# EAGLE design driver (EAGLE 9.5.1)

## Sheet 1 of 3
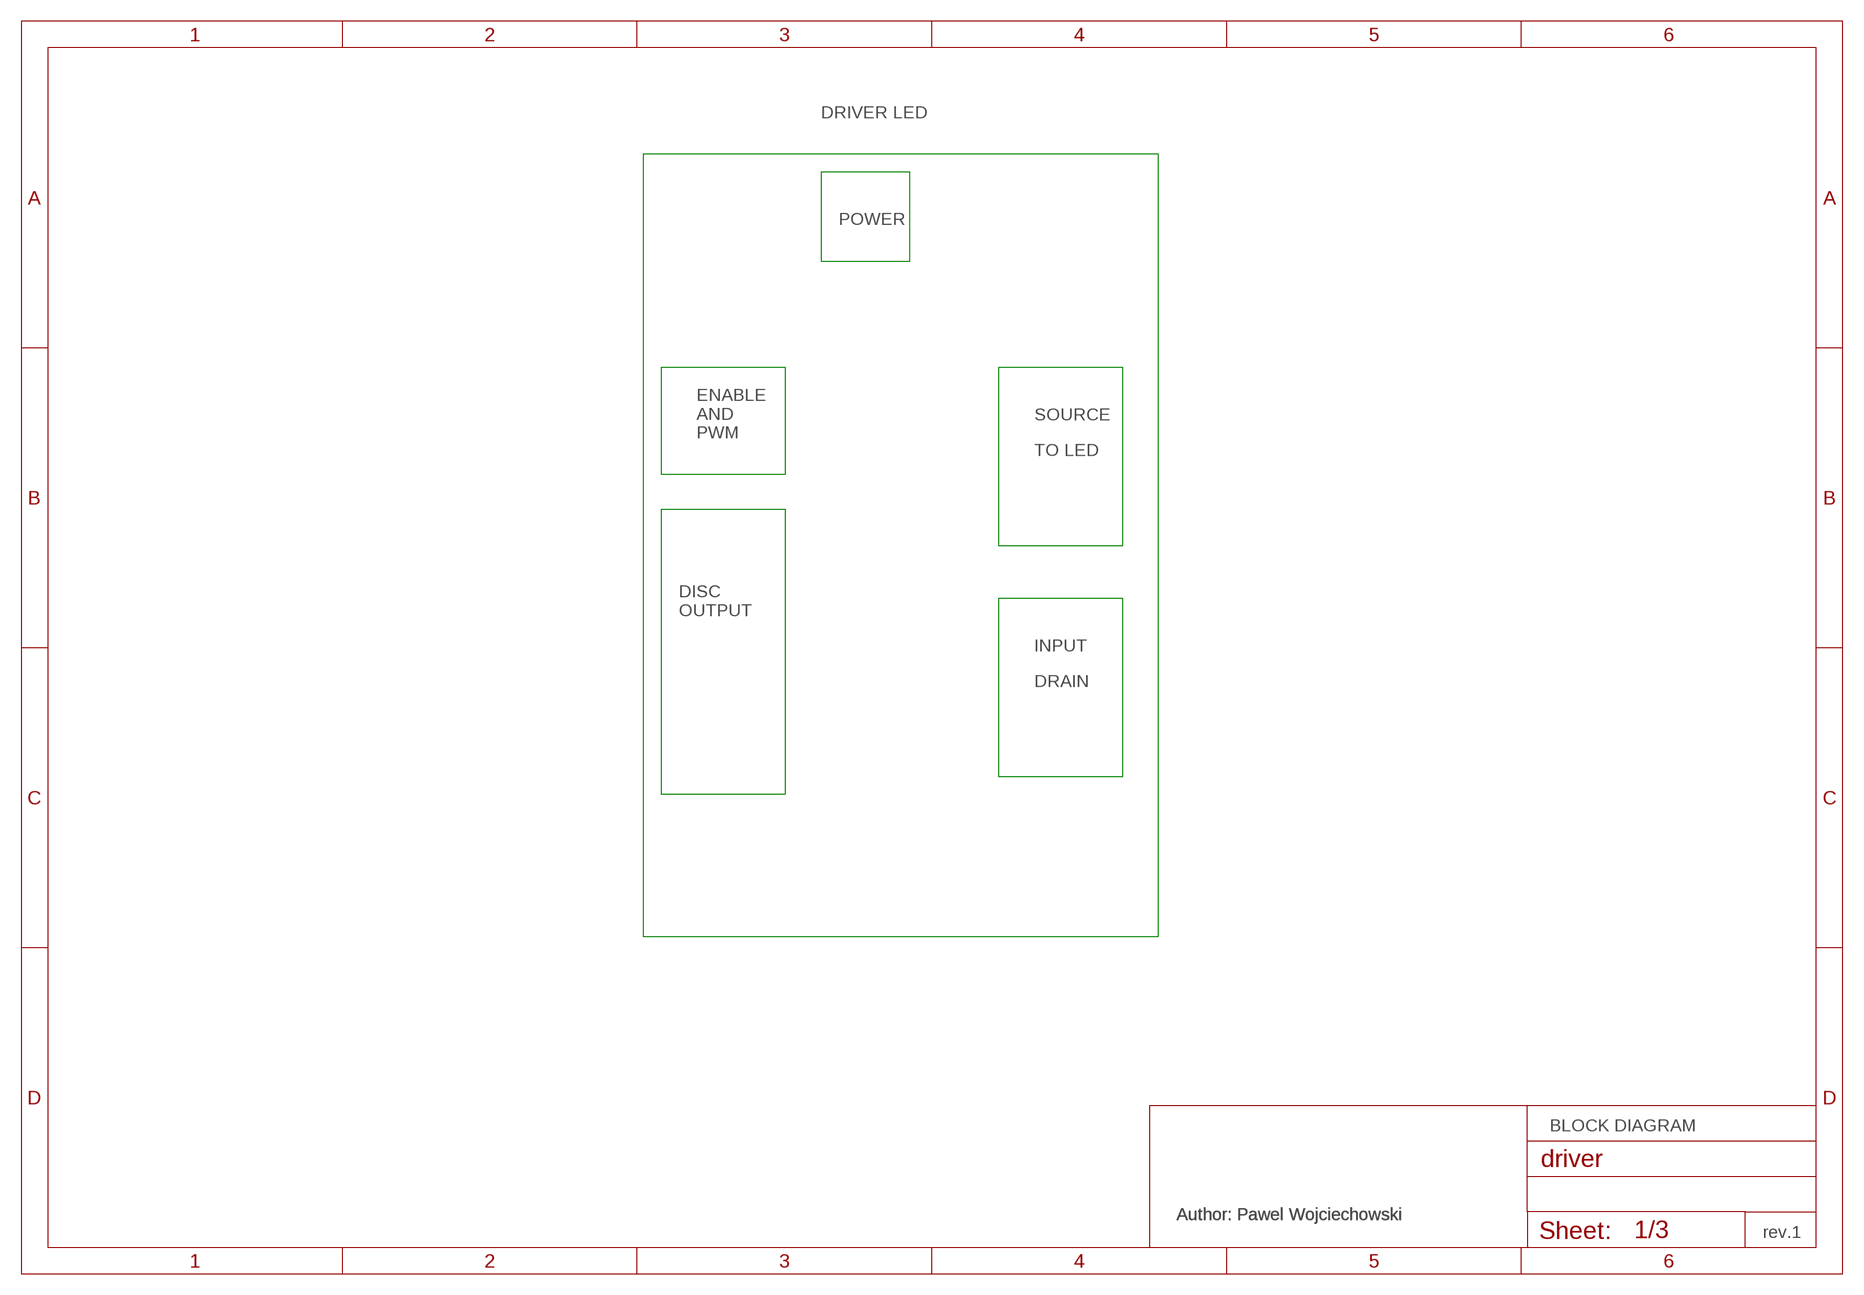
[diagram p0: schematic, sheet 1]

### Notes on the sheet
- DRIVER LED
- POWER
- SOURCE
- ENABLE
  AND
  PWM
- TO LED
- DISC
  OUTPUT
- INPUT
- DRAIN
- BLOCK DIAGRAM
- Author: Pawel Wojciechowski | Author: Pawel Wojciechowski
- rev.1

## Sheet 2 of 3
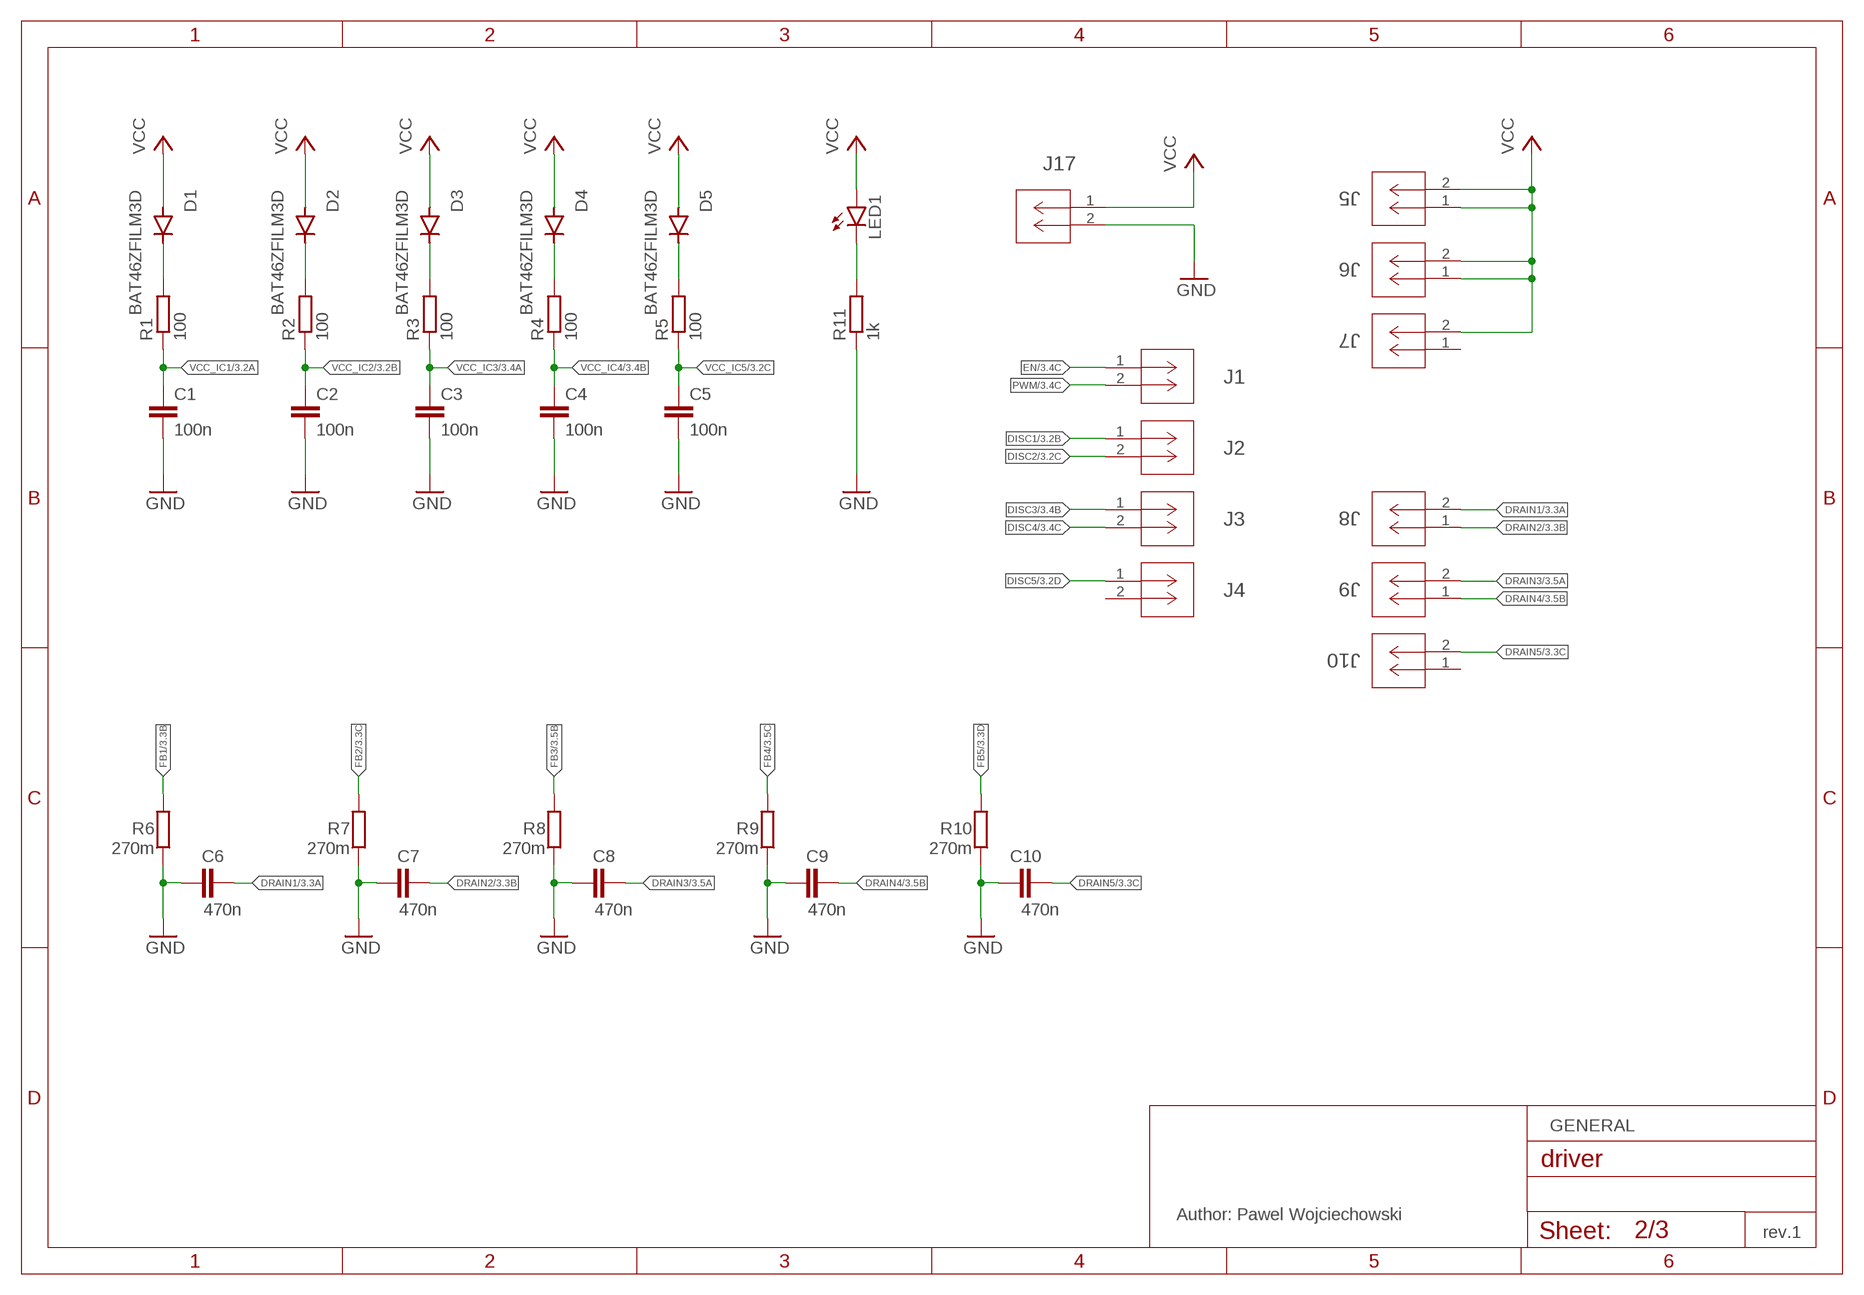
[diagram p1: schematic, sheet 2]

### Parts
C1  100n  C-EUC0603  [C0603]
C2  100n  C-EUC0603  [C0603]
C3  100n  C-EUC0603  [C0603]
C4  100n  C-EUC0603  [C0603]
C5  100n  C-EUC0603  [C0603]
C6  470n  C-EUC0805  [C0805]
C7  470n  C-EUC0805  [C0805]
C8  470n  C-EUC0805  [C0805]
C9  470n  C-EUC0805  [C0805]
C10  470n  C-EUC0805  [C0805]
D1  BAT46ZFILM3D  [SOD-123]
D2  BAT46ZFILM3D  [SOD-123]
D3  BAT46ZFILM3D  [SOD-123]
D4  BAT46ZFILM3D  [SOD-123]
D5  BAT46ZFILM3D  [SOD-123]
J1  1776275-2  [CONN2_1776275-2]
J2  1776275-2  [CONN2_1776275-2]
J3  1776275-2  [CONN2_1776275-2]
J4  1776275-2  [CONN2_1776275-2]
J5  1776275-2  [CONN2_1776275-2]
J6  1776275-2  [CONN2_1776275-2]
J7  1776275-2  [CONN2_1776275-2]
J8  1776275-2  [CONN2_1776275-2]
J9  1776275-2  [CONN2_1776275-2]
J10  1776275-2  [CONN2_1776275-2]
J17  1776275-2  [CONN2_1776275-2]
LED1  LEDSMT1206  [1206]
R1  100  R-EU_R0603  [R0603]
R2  100  R-EU_R0603  [R0603]
R3  100  R-EU_R0603  [R0603]
R4  100  R-EU_R0603  [R0603]
R5  100  R-EU_R0603  [R0603]
R6  270m  R-EU_R0603  [R0603]
R7  270m  R-EU_R0603  [R0603]
R8  270m  R-EU_R0603  [R0603]
R9  270m  R-EU_R0603  [R0603]
R10  270m  R-EU_R0603  [R0603]
R11  1k  R-EU_R0603  [R0603]

### Nets
DISC1: J2.1 ; also sheet 3
DISC2: J2.2 ; also sheet 3
DISC3: J3.1 ; also sheet 3
DISC4: J3.2 ; also sheet 3
DISC5: J4.1 ; also sheet 3
DRAIN1: C6.2 J8.2 ; also sheet 3
DRAIN2: C7.2 J8.1 ; also sheet 3
DRAIN3: C8.2 J9.2 ; also sheet 3
DRAIN4: C9.2 J9.1 ; also sheet 3
DRAIN5: C10.2 J10.2 ; also sheet 3
EN: J1.1 ; also sheet 3
FB1: R6.2 ; also sheet 3
FB2: R7.2 ; also sheet 3
FB3: R8.2 ; also sheet 3
FB4: R9.2 ; also sheet 3
FB5: R10.2 ; also sheet 3
GND: C1.2 C2.2 C3.2 C4.2 C5.2 C6.1 C7.1 C8.1 C9.1 C10.1 J17.2 R6.1 R7.1 R8.1 R9.1 R10.1 R11.1 ; also sheet 3
N$5: D1.C R1.2
N$6: D2.C R2.2
N$7: D3.C R3.2
N$8: D4.C R4.2
N$9: D5.C R5.2
N$10: LED1.C R11.2
PWM: J1.2 ; also sheet 3
VCC: D1.A D2.A D3.A D4.A D5.A J5.1 J5.2 J6.1 J6.2 J7.2 J17.1 LED1.A
VCC_IC1: C1.1 R1.1 ; also sheet 3
VCC_IC2: C2.1 R2.1 ; also sheet 3
VCC_IC3: C3.1 R3.1 ; also sheet 3
VCC_IC4: C4.1 R4.1 ; also sheet 3
VCC_IC5: C5.1 R5.1 ; also sheet 3
Unconnected: J4.2 J7.1 J10.1

### Notes on the sheet
- GENERAL
- Author: Pawel Wojciechowski
- rev.1

## Sheet 3 of 3
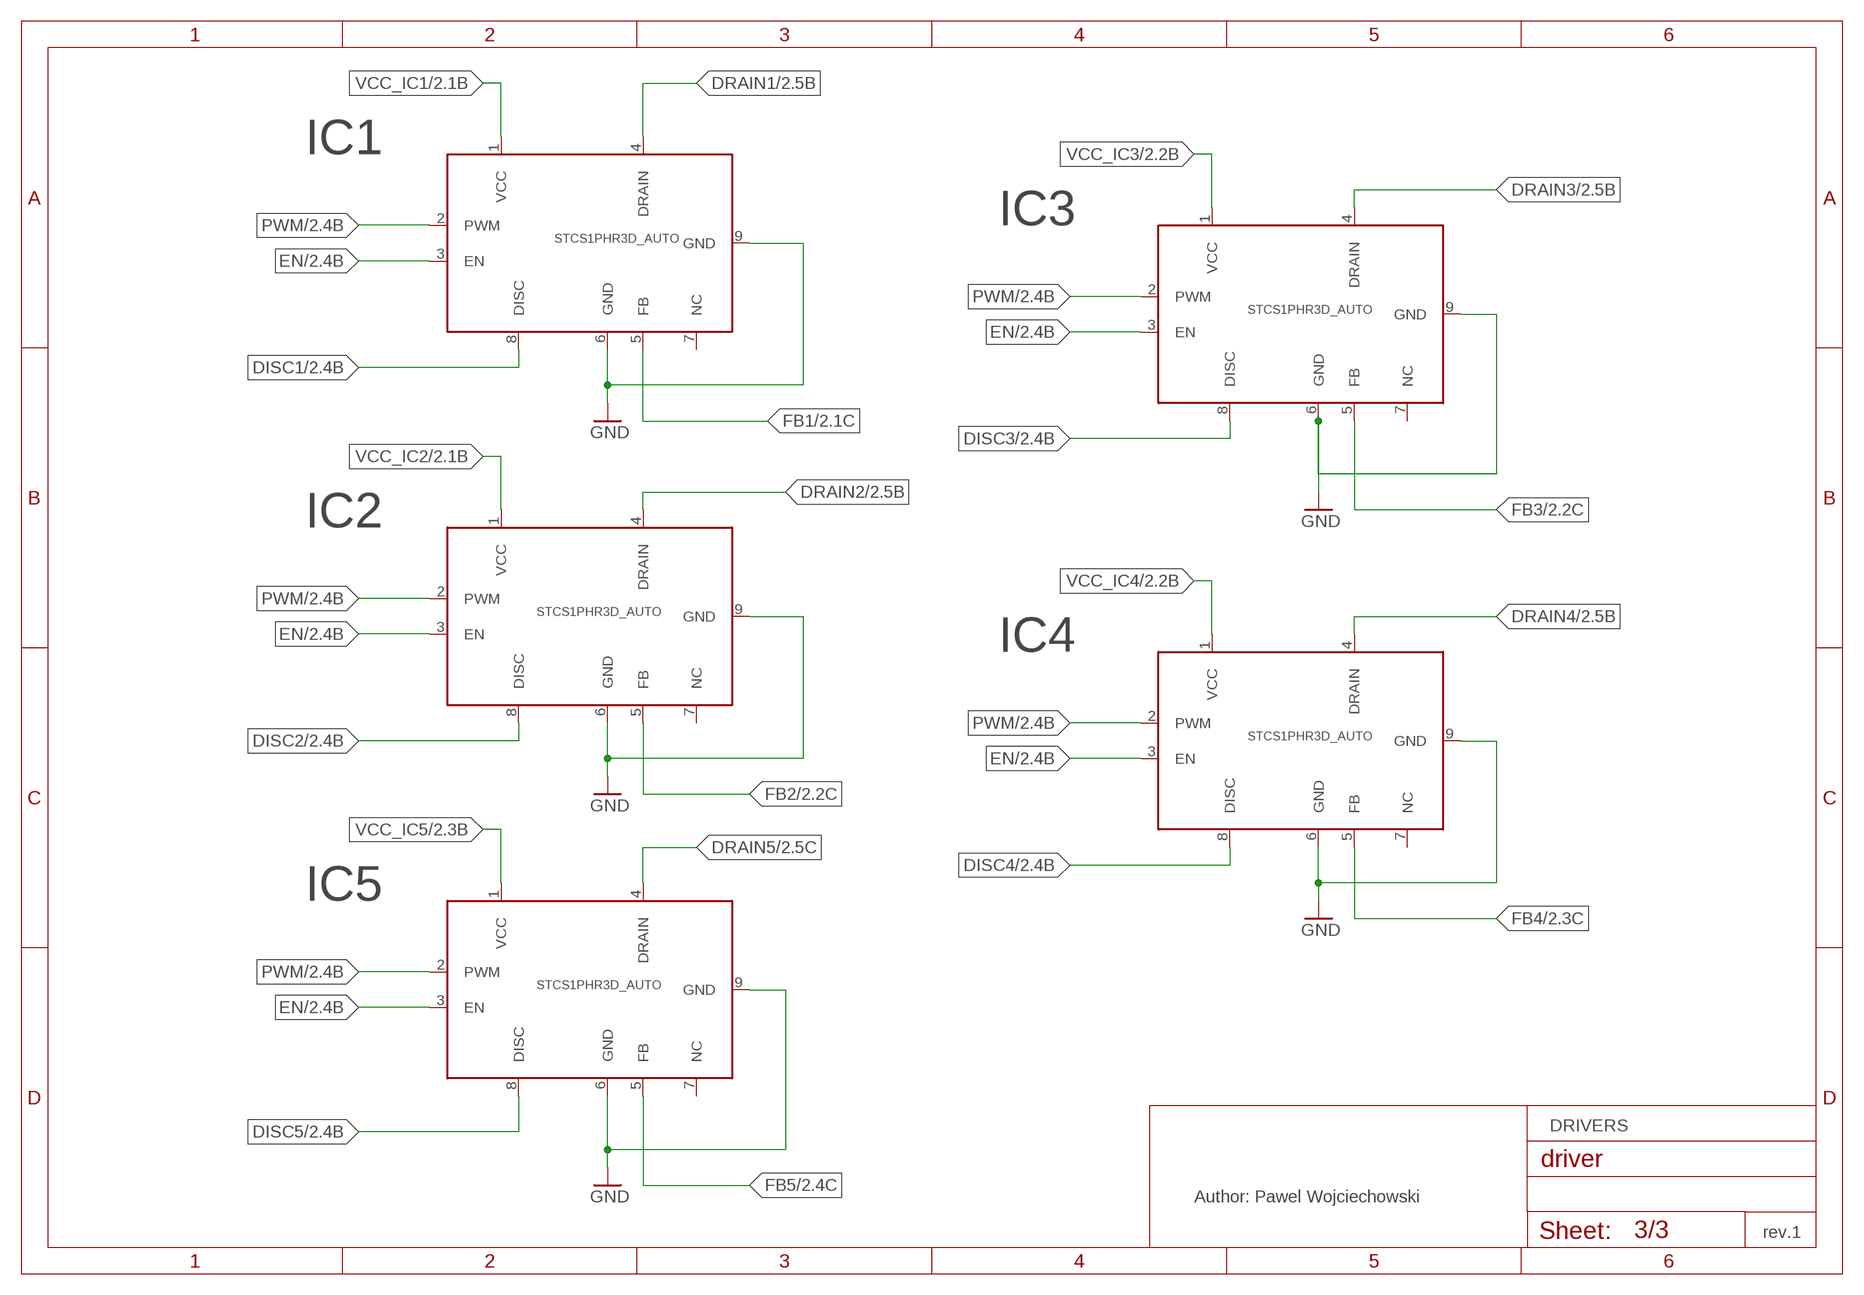
[diagram p2: schematic, sheet 3]

### Parts
IC1  STCS1PHR3D_AUTO  [SOIC127P600X170-9T251X320N]
IC2  STCS1PHR3D_AUTO  [SOIC127P600X170-9T251X320N]
IC3  STCS1PHR3D_AUTO  [SOIC127P600X170-9T251X320N]
IC4  STCS1PHR3D_AUTO  [SOIC127P600X170-9T251X320N]
IC5  STCS1PHR3D_AUTO  [SOIC127P600X170-9T251X320N]

### Nets
DISC1: IC1.8(DISC) ; also sheet 2
DISC2: IC2.8(DISC) ; also sheet 2
DISC3: IC3.8(DISC) ; also sheet 2
DISC4: IC4.8(DISC) ; also sheet 2
DISC5: IC5.8(DISC) ; also sheet 2
DRAIN1: IC1.4(DRAIN) ; also sheet 2
DRAIN2: IC2.4(DRAIN) ; also sheet 2
DRAIN3: IC3.4(DRAIN) ; also sheet 2
DRAIN4: IC4.4(DRAIN) ; also sheet 2
DRAIN5: IC5.4(DRAIN) ; also sheet 2
EN: IC1.3(EN) IC2.3(EN) IC3.3(EN) IC4.3(EN) IC5.3(EN) ; also sheet 2
FB1: IC1.5(FB) ; also sheet 2
FB2: IC2.5(FB) ; also sheet 2
FB3: IC3.5(FB) ; also sheet 2
FB4: IC4.5(FB) ; also sheet 2
FB5: IC5.5(FB) ; also sheet 2
GND: IC1.6(GND) IC1.9(GND) IC2.6(GND) IC2.9(GND) IC3.6(GND) IC3.9(GND) IC4.6(GND) IC4.9(GND) IC5.6(GND) IC5.9(GND) ; also sheet 2
PWM: IC1.2(PWM) IC2.2(PWM) IC3.2(PWM) IC4.2(PWM) IC5.2(PWM) ; also sheet 2
VCC_IC1: IC1.1(VCC) ; also sheet 2
VCC_IC2: IC2.1(VCC) ; also sheet 2
VCC_IC3: IC3.1(VCC) ; also sheet 2
VCC_IC4: IC4.1(VCC) ; also sheet 2
VCC_IC5: IC5.1(VCC) ; also sheet 2
Unconnected: IC1.7(NC) IC2.7(NC) IC3.7(NC) IC4.7(NC) IC5.7(NC)

### Notes on the sheet
- DRIVERS
- Author: Pawel Wojciechowski
- rev.1

## Library data of the parts
C1-C10 = rcl:C-EU: CAPACITOR, European symbol; SPICEPREFIX: C
D1-D5 = LED_LoRa:BAT46ZFILM
IC1-IC5 = LED_LoRa:STCS1PHR
J1-J10 J17 = TE_1776275-2:1776275-2; BUILT_BY: EMA_UL_Team; COPYRIGHT: Copyright (C) 2016 Accelerated Designs. All rights reserved; DATASHEET: https://www.te.com/commerce/DocumentDelivery/DDEController?Action=srchrtrv&DocNm=1776275&DocType=Customer+Drawing&DocLang=English&DocFormat=pdf&PartCntxt=1776275-2; DESCRIPTION: Vertical Term Blk Side Wire En; MANUFACTURER_PART_NUMBER: 1776275-2; PITCH_MM_: 3.5; POSITIONS: 2; PRODUCT: Terminal Block Headers & Receptacles; ROWS-CONFIG: -; SOURCELIBRARY: TE_Connectivity_250_Part_Delivery_6_2018-09-18; TE_PART_NUMBER: 1776275-2; TYPE: Receptacle; VENDOR: TE Connectivity
LED1 = led:LED: LED OSRAM: - CHIPLED LG R971, LG N971, LY N971, LG Q971, LY Q971, LO R971, LY R971 LH N974, LH R974 LS Q976, LO Q976, LY Q976 LO Q996 - Hyper CHIPLED LW Q18S LB Q993, LB Q99A, LB R99A - SideLED LS A670, LO A670, LY A670, LG A670, LP A670 LB A673, LV A673, LT A673, LW A673 LH A674 LY A675 LS A676, LA A676, LO A676, LY A676, LW A676 LS A679, LY A679, LG A679 - Hyper Micro SIDELED® LS Y876, LA Y876, LO Y876, LY Y876 LT Y87S - SmartLED LW L88C, LW L88S LB L89C, LB L89S, LG L890 LS L89K, LO L89K, LY L89K LS L896, LA L896, LO L896, LY L896 - TOPLED LS T670, LO T670, LY T670, LG T670, LP T670 LSG T670, LSP T670, LSY T670, LOP T670, LYG T670 LG T671, LOG T671, LSG T671 LB T673, LV T673, LT T673, LW T673 LH T674 LS T676, LA T676, LO T676, LY T676, LB T676, LH T676, LSB T676, LW T676 LB T67C, LV T67C, LT T67C, LS T67K, LO T67K, LY T67K, LW E67C LS E67B, LA E67B, LO E67B, LY E67B, LB E67C, LV E67C, LT E67C LW T67C LS T679, LY T679, LG T679 LS T770, LO T770, LY T770, LG T770, LP T770 LB T773, LV T773, LT T773, LW T773 LH T774 LS E675, LA E675, LY E675, LS T675 LS T776, LA T776, LO T776, LY T776, LB T776 LHGB T686 LT T68C, LB T68C - Hyper Mini TOPLED® LB M676 - Mini TOPLED Santana® LG M470 LS M47K, LO M47K, LY M47K Source: http://www.osram.convergy.de LUXEON: - LUMILED® LXK2-PW12-R00, LXK2-PW12-S00, LXK2-PW14-U00, LXK2-PW14-V00 LXK2-PM12-R00, LXK2-PM12-S00, LXK2-PM14-U00 LXK2-PE12-Q00, LXK2-PE12-R00, LXK2-PE12-S00, LXK2-PE14-T00, LXK2-PE14-U00 LXK2-PB12-K00, LXK2-PB12-L00, LXK2-PB12-M00, LXK2-PB14-N00, LXK2-PB14-P00, LXK2-PB14-Q00 LXK2-PR12-L00, LXK2-PR12-M00, LXK2-PR14-Q00, LXK2-PR14-R00 LXK2-PD12-Q00, LXK2-PD12-R00, LXK2-PD12-S00 LXK2-PH12-R00, LXK2-PH12-S00 LXK2-PL12-P00, LXK2-PL12-Q00, LXK2-PL12-R00 Source: www.luxeon.com KINGBRIGHT: KA-3528ASYC Source: www.kingbright.com
R1-R11 = rcl:R-EU_: RESISTOR, European symbol; SPICEPREFIX: R

## Board
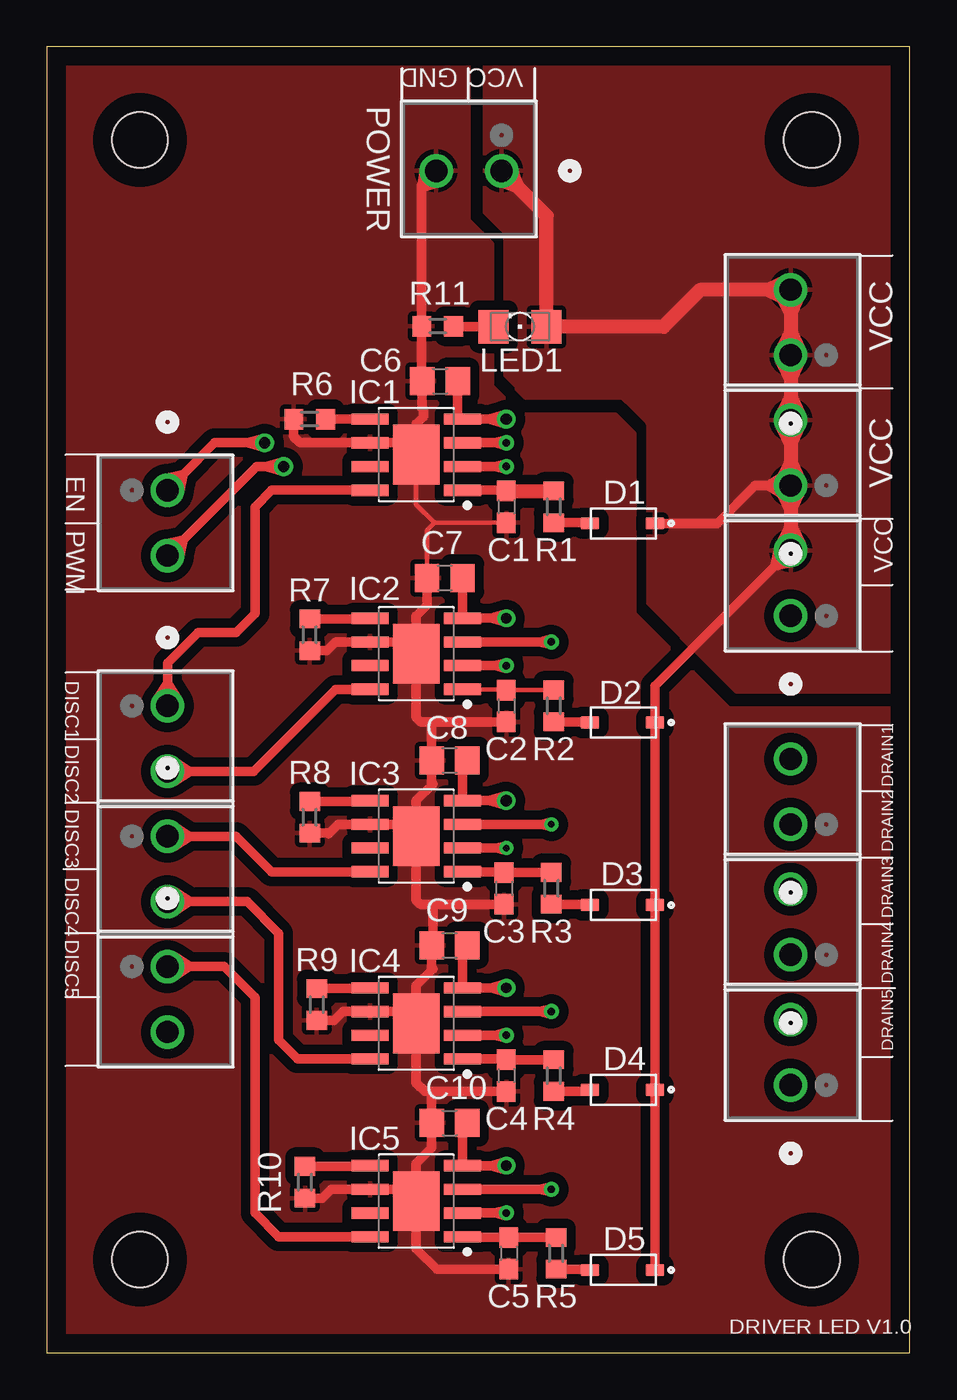
[diagram p3: board, top side]
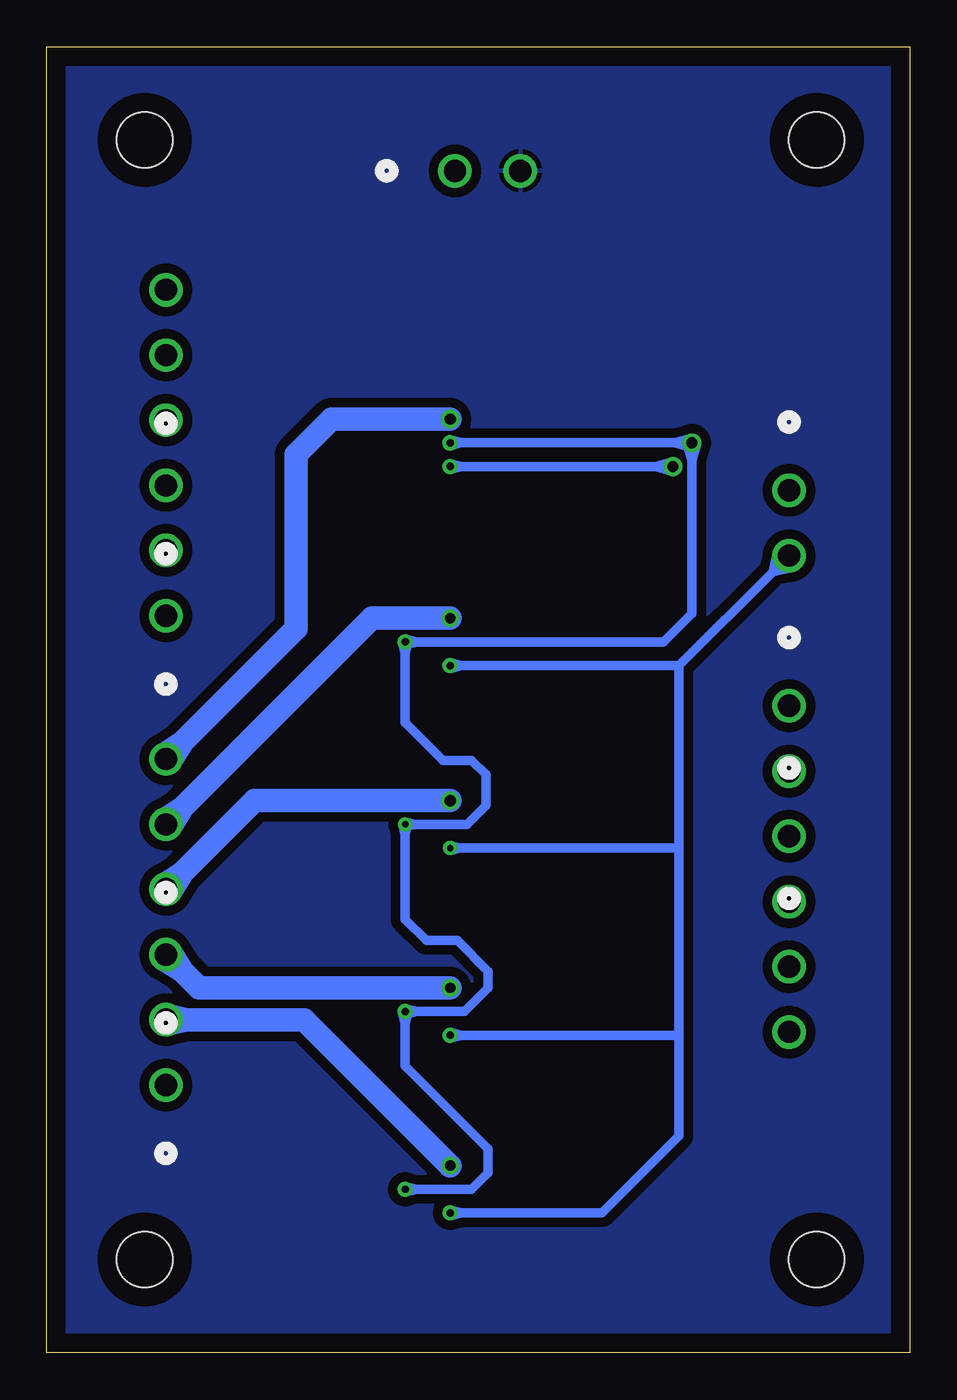
[diagram p4: board, bottom side, seen from below]

Size 46.27 x 70 mm. Coordinates in mm from the lower left corner, seen from the top.
Outline: 0,0 46.27,0 46.27,70 0,70 0,0
Copper layers (1*16): Top 0.035mm / dielectric 1.5mm / Bottom 0.035mm
Design rules "default": minimum track width 6mil, minimum drill 0.35mm, track to track 6mil, track to pad 6mil, pad to pad 6mil, via to via 6mil, smd to smd 6mil, copper to edge 40mil, drill to drill 6mil, minimum pad ring 10mil, minimum via ring 8mil, stop-mask expansion 4mil, vias tented up to drill 0mil, thermal gap 10mil
Holes 3 mm at 5,65 5,5 41.02,65 41.02,5

### Footprints (pad centres in the part's own frame; a part is rotated, then mirrored left to right if it is on the bottom)
C0603 = smd 1.1 x 1: 1 -0.85,0; 2 0.85,0
C0805 = smd 1.3 x 1.5: 1 -0.95,0; 2 0.95,0
SOD-123 = smd 0.97 x 0.65: A 1.74,0; C -1.74,0
SOIC127P600X170-9T251X320N = smd 1.968 x 0.599: 1 -2.473,1.905; 2 -2.473,0.635; 3 -2.473,-0.635; 4 -2.473,-1.905; 5 2.473,-1.905; 6 2.473,-0.635; 7 2.473,0.635; 8 2.473,1.905 | smd 2.51 x 3.2: 9 0,0
CONN2_1776275-2 = drill 1.194 pad 1.702: 1 0,0; 2 3.505,0
1206 = smd 1.6 x 1.803: A -1.422,0; C 1.422,0
R0603 = smd 1 x 1.1: 1 -0.85,0; 2 0.85,0

### Placement (x,y rotation side)
C1  24.64,45.34 270 top
C2  24.64,34.67 270 top
C3  24.51,24.89 270 top
C4  24.64,14.86 270 top
C5  24.77,5.33 270 top
C6  21.08,52.07 0 top
C7  21.34,41.53 0 top
C8  21.59,31.75 0 top
C9  21.59,21.84 0 top
C10  21.59,12.32 0 top
D1  30.86,44.45 0 top
D2  30.86,33.78 0 top
D3  30.86,24 0 top
D4  30.86,14.1 0 top
D5  30.86,4.45 0 top
IC1  19.81,48.13 180 top
IC2  19.81,37.47 180 top
IC3  19.81,27.69 180 top
IC4  19.81,17.65 180 top
IC5  19.81,8.13 180 top
J1  6.48,46.23 270 top
J2  6.48,34.67 270 top
J3  6.48,27.69 270 top
J4  6.48,20.7 270 top
J5  39.88,46.48 90 top
J6  39.88,53.47 90 top
J7  39.88,39.5 90 top
J8  39.88,28.32 90 top
J9  39.88,21.34 90 top
J10  39.88,14.35 90 top
J17  24.38,63.34 180 top
LED1  25.37,54.99 180 top
R1  27.18,45.34 270 top
R2  27.18,34.67 270 top
R3  27.05,24.89 270 top
R4  27.18,14.86 270 top
R5  27.3,5.33 270 top
R6  14.1,50.04 0 top
R7  14.1,38.48 90 top
R8  14.1,28.7 90 top
R9  14.48,18.67 90 top
R10  13.84,9.14 90 top
R11  20.95,55.02 0 top

### Tracks (layer width: path | path; a pad name or v marks a point on that pad's centre or on a via)
DISC1
  Top 0.508: IC1.8 12.06,46.23 11.18,45.34 11.18,39.62 10.16,38.61 8.13,38.61 6.48,36.96 6.48,35.87 | 6.48,35.87 J2.1 | 6.48,35.87 5.94,35.02 J2.1 | 6.48,35.87 7.02,35.02 J2.1
DISC2
  Top 0.508: IC2.8 15.49,35.56 11.1,31.17 7.67,31.17 | 7.67,31.17 J2.2 | 7.67,31.17 6.82,31.71 J2.2 | 7.67,31.17 6.82,30.62 J2.2
DISC3
  Top 0.508: IC3.8 12.06,25.78 10.16,27.69 7.67,27.69 | 7.67,27.69 J3.1 | 7.67,27.69 6.82,28.23 J3.1 | 7.67,27.69 6.82,27.14 J3.1
DISC4
  Top 0.508: IC4.8 13.46,15.75 12.45,16.76 12.45,22.48 10.74,24.18 7.67,24.18 | 7.67,24.18 J3.2 | 7.67,24.18 6.82,24.72 J3.2 | 7.67,24.18 6.82,23.64 J3.2
DISC5
  Top 0.508: IC5.8 12.45,6.22 11.18,7.49 11.18,19.05 9.53,20.7 7.67,20.7 | 7.67,20.7 J4.1 | 7.67,20.7 6.82,21.24 J4.1 | 7.67,20.7 6.82,20.16 J4.1
DRAIN1  (via drill 0.6)
  Top 0.508: C6.2 22.03,50.29 IC1.4 23.74,50.04 | v24.64,50.04 23.74,50.04 | 23.74,50.04 | 23.74,50.04 24.57,49.8 | 24.57,49.8 | v24.64,50.04 24.57,49.8 | 23.74,50.04 24.57,50.28 | 23.74,50.04 24.57,49.8 | 23.74,50.04 | 23.74,50.04 24.57,49.8 | v24.64,50.04 24.57,49.8 | 23.74,50.04 24.57,50.28 | 24.57,50.28 | v24.64,50.04 24.57,50.28 | 23.74,50.04 24.57,49.8 | 23.74,50.04 24.57,50.28 | 23.74,50.04 24.57,49.8 | v24.64,50.04 24.57,49.8 | 23.74,50.04 24.57,50.28 | v24.64,50.04 24.57,50.28
  Bottom 1.27: J8.2 39.7,32 | v24.64,50.04 30.99,50.04 32.89,48.13 32.89,38.81 39.03,32.67 | 39.03,32.67 J8.2 | 39.03,32.67 39.66,31.69 J8.2 | 39.03,32.67 40.02,32.05 J8.2
DRAIN2  (via drill 0.55)
  Top 0.508: IC2.4 | v24.64,39.37 23.81,39.37 | 23.81,39.37 | 23.81,39.37 IC2.4 | C7.2 IC2.4 | 24.58,39.15 | v24.64,39.37 24.58,39.15 | 23.81,39.37 24.58,39.15 | 23.81,39.37 24.58,39.59 | 24.58,39.59 | v24.64,39.37 24.58,39.59 | 23.81,39.37 | 23.81,39.37 24.58,39.15 | 24.58,39.15 | 24.58,39.15 | v24.64,39.37 24.58,39.15 | 23.81,39.37 24.58,39.59 | 23.81,39.37 24.58,39.15 | v24.64,39.37 24.58,39.15 | 23.81,39.37 24.58,39.59 | 24.58,39.59 | v24.64,39.37 24.58,39.59 | 23.81,39.37 24.58,39.15 | v24.64,39.37 24.58,39.15 | 23.81,39.37 24.58,39.59 | v24.64,39.37 24.58,39.59
  Bottom 1.27: 39.03,29.16 28.83,39.37 v24.64,39.37 | 39.03,29.16 J8.1 | 39.03,29.16 39.66,28.18 J8.1 | 39.03,29.16 40.02,28.54 J8.1
DRAIN3  (via drill 0.6)
  Top 0.508: C8.2 22.29,31.5 IC3.4 23.74,29.59 | v24.64,29.59 23.74,29.59 | 23.74,29.59 | 23.74,29.59 24.57,29.35 | 24.57,29.35 | v24.64,29.59 24.57,29.35 | 23.74,29.59 24.57,29.83 | 23.74,29.59 24.57,29.35 | 23.74,29.59 | 23.74,29.59 24.57,29.35 | v24.64,29.59 24.57,29.35 | 23.74,29.59 24.57,29.83 | 24.57,29.83 | v24.64,29.59 24.57,29.83 | 23.74,29.59 24.57,29.35 | 23.74,29.59 24.57,29.83 | 23.74,29.59 24.57,29.35 | v24.64,29.59 24.57,29.35 | 23.74,29.59 24.57,29.83 | v24.64,29.59 24.57,29.83
  Bottom 1.27: v24.64,29.59 35.13,29.59 39.03,25.68 | 39.03,25.68 J9.2 | 39.03,25.68 39.66,24.7 J9.2 | 39.03,25.68 40.02,25.06 J9.2
DRAIN4  (via drill 0.55)
  Top 0.508: C9.2 22.29,21.59 IC4.4 23.81,19.56 | v24.64,19.56 23.81,19.56 | 23.81,19.56 | 24.58,19.34 | v24.64,19.56 24.58,19.34 | 23.81,19.56 24.58,19.34 | 23.81,19.56 24.58,19.77 | 24.58,19.77 | v24.64,19.56 24.58,19.77 | 23.81,19.56 | 23.81,19.56 24.58,19.34 | 24.58,19.34 | 24.58,19.34 | v24.64,19.56 24.58,19.34 | 23.81,19.56 24.58,19.77 | 23.81,19.56 24.58,19.34 | v24.64,19.56 24.58,19.34 | 23.81,19.56 24.58,19.77 | 24.58,19.77 | v24.64,19.56 24.58,19.77 | 23.81,19.56 24.58,19.34 | v24.64,19.56 24.58,19.34 | 23.81,19.56 24.58,19.77 | v24.64,19.56 24.58,19.77
  Bottom 1.27: v24.64,19.56 38.1,19.56 39.03,20.49 | 39.03,20.49 J9.1 | 39.03,20.49 40.02,21.12 J9.1 | 39.03,20.49 39.66,21.48 J9.1
DRAIN5  (via drill 0.55)
  Top 0.508: C10.2 22.29,12.06 IC5.4 23.81,10.03 | v24.64,10.03 23.81,10.03 | 23.81,10.03 | 24.58,9.82 | v24.64,10.03 24.58,9.82 | 23.81,10.03 24.58,9.82 | 23.81,10.03 24.58,10.25 | 24.58,10.25 | v24.64,10.03 24.58,10.25 | 23.81,10.03 | 23.81,10.03 24.58,9.82 | 24.58,9.82 | 24.58,9.82 | v24.64,10.03 24.58,9.82 | 23.81,10.03 24.58,10.25 | 23.81,10.03 24.58,9.82 | v24.64,10.03 24.58,9.82 | 23.81,10.03 24.58,10.25 | 24.58,10.25 | v24.64,10.03 24.58,10.25 | 23.81,10.03 24.58,9.82 | v24.64,10.03 24.58,9.82 | 23.81,10.03 24.58,10.25 | v24.64,10.03 24.58,10.25
  Bottom 1.27: v24.64,10.03 32.46,17.86 38.68,17.86 | 38.68,17.86 J10.2 | 38.68,17.86 39.82,17.6 J10.2 | 38.68,17.86 39.82,18.11 J10.2
EN  (via drill 0.35, 0.4, 0.6)
  Top 0.508: J1.1 7.32,47.07 | 7.32,47.07 | 7.32,47.07 9.02,48.77 10.78,48.77 | 10.78,48.77 | 10.78,48.77 v11.68,48.77 | v24.64,48.77 24.04,48.77 | 24.04,48.77 | 24.04,48.77 IC1.3 | IC2.3 26.45,38.1 | 26.45,38.1 | 26.45,38.1 v27.05,38.1 | IC3.3 26.53,28.32 | 26.53,28.32 | 26.53,28.32 v27.05,28.32 | IC4.3 26.45,18.29 | 26.45,18.29 | 26.45,18.29 v27.05,18.29 | IC5.3 26.45,8.76 | 26.45,8.76 | 26.45,8.76 v27.05,8.76 | 10.78,48.77 11.62,48.53 | 11.62,48.53 | v11.68,48.77 11.62,48.53 | 10.78,48.77 11.62,49.01 | 24.04,48.77 24.6,48.62 | 24.04,48.77 24.6,48.91 | 26.45,38.1 27.01,37.95 | 26.45,38.1 27.01,38.24 | 26.53,28.32 27.02,28.2 | 26.53,28.32 27.02,28.44 | 26.45,18.29 27.01,18.14 | 26.45,18.29 27.01,18.43 | 26.45,8.76 27.01,8.62 | 26.45,8.76 27.01,8.91 | 10.78,48.77 11.62,48.53 | 10.78,48.77 | 10.78,48.77 11.62,48.53 | v11.68,48.77 11.62,48.53 | 10.78,48.77 11.62,49.01 | 11.62,49.01 | v11.68,48.77 11.62,49.01 | 10.78,48.77 11.62,48.53 | 10.78,48.77 11.62,49.01 | 10.78,48.77 11.62,48.53 | v11.68,48.77 11.62,48.53 | 10.78,48.77 11.62,49.01 | v11.68,48.77 11.62,49.01 | 24.04,48.77 | 24.04,48.77 24.6,48.62 | 24.6,48.62 | v24.64,48.77 24.6,48.62 | 24.04,48.77 24.6,48.91 | 24.6,48.91 | v24.64,48.77 24.6,48.91 | 24.04,48.77 24.6,48.62 | 24.04,48.77 24.6,48.91 | 24.04,48.77 24.6,48.62 | v24.64,48.77 24.6,48.62 | 24.04,48.77 24.6,48.91 | v24.64,48.77 24.6,48.91 | 26.45,38.1 | 26.45,38.1 27.01,37.95 | 27.01,37.95 | v27.05,38.1 27.01,37.95 | 26.45,38.1 27.01,38.24 | 27.01,38.24 | v27.05,38.1 27.01,38.24 | 26.45,38.1 27.01,37.95 | 26.45,38.1 27.01,38.24 | 26.45,38.1 27.01,37.95 | v27.05,38.1 27.01,37.95 | 26.45,38.1 27.01,38.24 | v27.05,38.1 27.01,38.24 | 26.53,28.32 | 26.53,28.32 27.02,28.2 | 27.02,28.2 | v27.05,28.32 27.02,28.2
  Top 0.508: 26.53,28.32 27.02,28.44 | 27.02,28.44 | v27.05,28.32 27.02,28.44 | 26.53,28.32 27.02,28.2 | 26.53,28.32 27.02,28.44 | 26.53,28.32 27.02,28.2 | v27.05,28.32 27.02,28.2 | 26.53,28.32 27.02,28.44 | v27.05,28.32 27.02,28.44 | 26.45,18.29 | 26.45,18.29 27.01,18.14 | 27.01,18.14 | v27.05,18.29 27.01,18.14 | 26.45,18.29 27.01,18.43 | 27.01,18.43 | v27.05,18.29 27.01,18.43 | 26.45,18.29 27.01,18.14 | 26.45,18.29 27.01,18.43 | 26.45,18.29 27.01,18.14 | v27.05,18.29 27.01,18.14 | 26.45,18.29 27.01,18.43 | v27.05,18.29 27.01,18.43 | 26.45,8.76 | 26.45,8.76 27.01,8.62 | 27.01,8.62 | v27.05,8.76 27.01,8.62 | 26.45,8.76 27.01,8.91 | 27.01,8.91 | v27.05,8.76 27.01,8.91 | 26.45,8.76 27.01,8.62 | 26.45,8.76 27.01,8.91 | 26.45,8.76 27.01,8.62 | v27.05,8.76 27.01,8.62 | 26.45,8.76 27.01,8.91 | v27.05,8.76 27.01,8.91 | 7.32,47.07 6.34,46.85 | 6.34,46.85 | 7.32,47.07 7.1,46.09 | 7.32,47.07 6.34,46.85 | J1.1 6.34,46.85 | 7.32,47.07 7.1,46.09 | 7.1,46.09 | 7.32,47.07 6.34,46.85 | J1.1 6.34,46.85 | 7.32,47.07 7.1,46.09 | J1.1 7.1,46.09
  Bottom 0.508: v11.68,48.77 12.58,48.77 | 12.58,48.77 | 12.58,48.77 24.04,48.77 | 24.04,48.77 | 24.04,48.77 v24.64,48.77 | v27.05,28.32 26.53,28.32 | 26.53,28.32 | 26.53,28.32 23.75,28.32 22.73,29.34 22.73,30.99 23.5,31.75 25.02,31.75 27.05,33.78 27.05,37.5 | 27.05,37.5 | 27.05,37.5 v27.05,38.1 | v27.05,18.29 26.45,18.29 | 26.45,18.29 | 26.45,18.29 23.88,18.29 22.61,19.56 22.61,20.45 24.26,22.1 25.91,22.1 27.05,23.24 27.05,27.8 | 27.05,27.8 | 27.05,27.8 v27.05,28.32 | v27.05,8.76 26.45,8.76 | 26.45,8.76 | 26.45,8.76 23.5,8.76 22.61,9.65 22.61,10.92 27.05,15.37 27.05,17.69 | 27.05,17.69 | 27.05,17.69 v27.05,18.29 | v11.68,48.77 11.68,47.87 | 11.68,47.87 | 11.68,47.87 11.68,39.62 13.21,38.1 26.45,38.1 | 26.45,38.1 | 26.45,38.1 v27.05,38.1 | 12.58,48.77 11.75,49.01 | 12.58,48.77 11.75,48.53 | 11.75,49.01 | 11.75,48.53 | v11.68,48.77 11.75,48.53 | 11.68,47.87 11.92,48.7 | 11.68,47.87 11.45,48.7 | 11.92,48.7 | 11.45,48.7 | v11.68,48.77 11.45,48.7 | 24.04,48.77 24.6,48.62 | 24.04,48.77 24.6,48.91 | 27.05,37.5 27.2,38.06 | 27.05,37.5 26.91,38.06 | 27.2,38.06 | 26.91,38.06 | 26.45,38.1 27.01,37.95 | 26.45,38.1 27.01,38.24 | 26.53,28.32 27.02,28.2 | 26.53,28.32 27.02,28.44 | 27.05,27.8 27.17,28.29 | 27.05,27.8 26.93,28.29 | 27.17,28.29 | 26.93,28.29 | 26.45,18.29 27.01,18.14 | 26.45,18.29 27.01,18.43 | 27.05,17.69 27.2,18.25 | 27.05,17.69 26.91,18.25 | 27.2,18.25 | 26.91,18.25 | 26.45,8.76 27.01,8.62 | 26.45,8.76 27.01,8.91 | 12.58,48.77 11.75,49.01 | 12.58,48.77 | 12.58,48.77 11.75,48.53 | 12.58,48.77 11.75,49.01 | v11.68,48.77 11.75,49.01 | 12.58,48.77 11.75,48.53 | v11.68,48.77 11.75,48.53 | 12.58,48.77 11.75,49.01 | v11.68,48.77 11.75,49.01 | 12.58,48.77 11.75,48.53 | v11.68,48.77 11.75,48.53 | 11.68,47.87 11.92,48.7
  Bottom 0.508: 11.68,47.87 | 11.68,47.87 11.45,48.7 | 11.68,47.87 11.92,48.7 | v11.68,48.77 11.92,48.7 | 11.68,47.87 11.45,48.7 | v11.68,48.77 11.45,48.7 | 11.68,47.87 11.92,48.7 | v11.68,48.77 11.92,48.7 | 11.68,47.87 11.45,48.7 | v11.68,48.77 11.45,48.7 | 24.04,48.77 | 24.04,48.77 24.6,48.62 | 24.6,48.62 | v24.64,48.77 24.6,48.62 | 24.04,48.77 24.6,48.91 | 24.6,48.91 | v24.64,48.77 24.6,48.91 | 24.04,48.77 24.6,48.62 | 24.04,48.77 24.6,48.91 | 24.04,48.77 24.6,48.62 | v24.64,48.77 24.6,48.62 | 24.04,48.77 24.6,48.91 | v24.64,48.77 24.6,48.91 | 26.45,38.1 | 27.05,37.5 27.2,38.06 | 27.05,37.5 | 27.05,37.5 26.91,38.06 | 27.05,37.5 27.2,38.06 | v27.05,38.1 27.2,38.06 | 27.05,37.5 26.91,38.06 | v27.05,38.1 26.91,38.06 | 27.05,37.5 27.2,38.06 | v27.05,38.1 27.2,38.06 | 27.05,37.5 26.91,38.06 | v27.05,38.1 26.91,38.06 | 26.45,38.1 27.01,37.95 | 27.01,37.95 | v27.05,38.1 27.01,37.95 | 26.45,38.1 27.01,38.24 | 27.01,38.24 | v27.05,38.1 27.01,38.24 | 26.45,38.1 27.01,37.95 | 26.45,38.1 27.01,38.24 | 26.45,38.1 27.01,37.95 | v27.05,38.1 27.01,37.95 | 26.45,38.1 27.01,38.24 | v27.05,38.1 27.01,38.24 | 26.53,28.32 | 26.53,28.32 27.02,28.2 | 27.02,28.2 | v27.05,28.32 27.02,28.2 | 26.53,28.32 27.02,28.44 | 27.02,28.44 | v27.05,28.32 27.02,28.44 | 26.53,28.32 27.02,28.2 | 26.53,28.32 27.02,28.44 | 26.53,28.32 27.02,28.2 | v27.05,28.32 27.02,28.2 | 26.53,28.32 27.02,28.44 | v27.05,28.32 27.02,28.44 | 27.05,27.8 27.17,28.29 | 27.05,27.8 | 27.05,27.8 26.93,28.29 | 27.05,27.8 27.17,28.29 | v27.05,28.32 27.17,28.29 | 27.05,27.8 26.93,28.29 | v27.05,28.32 26.93,28.29 | 27.05,27.8 27.17,28.29 | v27.05,28.32 27.17,28.29 | 27.05,27.8 26.93,28.29 | v27.05,28.32 26.93,28.29 | 26.45,18.29 | 26.45,18.29 27.01,18.14 | 27.01,18.14 | v27.05,18.29 27.01,18.14
  Bottom 0.508: 26.45,18.29 27.01,18.43 | 27.01,18.43 | v27.05,18.29 27.01,18.43 | 26.45,18.29 27.01,18.14 | 26.45,18.29 27.01,18.43 | 26.45,18.29 27.01,18.14 | v27.05,18.29 27.01,18.14 | 26.45,18.29 27.01,18.43 | v27.05,18.29 27.01,18.43 | 27.05,17.69 27.2,18.25 | 27.05,17.69 | 27.05,17.69 26.91,18.25 | 27.05,17.69 27.2,18.25 | v27.05,18.29 27.2,18.25 | 27.05,17.69 26.91,18.25 | v27.05,18.29 26.91,18.25 | 27.05,17.69 27.2,18.25 | v27.05,18.29 27.2,18.25 | 27.05,17.69 26.91,18.25 | v27.05,18.29 26.91,18.25 | 26.45,8.76 | 26.45,8.76 27.01,8.62 | 27.01,8.62 | v27.05,8.76 27.01,8.62 | 26.45,8.76 27.01,8.91 | 27.01,8.91 | v27.05,8.76 27.01,8.91 | 26.45,8.76 27.01,8.62 | 26.45,8.76 27.01,8.91 | 26.45,8.76 27.01,8.62 | v27.05,8.76 27.01,8.62 | 26.45,8.76 27.01,8.91 | v27.05,8.76 27.01,8.91
FB1
  Top 0.508: R6.2 IC1.5
FB2
  Top 0.508: R7.2 17.3,39.33 IC2.5
FB3
  Top 0.508: R8.2 17.3,29.55 IC3.5
FB4
  Top 0.508: R9.2 17.3,19.52 IC4.5
FB5
  Top 0.508: R10.2 17.3,9.99 IC5.5
GND
  Top 0.254: C1.2 20.79,44.49 | IC1.9 19.81,45.47 20.79,44.49 | C7.1 20.39,44.09 20.79,44.49
  Top 0.508: 20.11,62.44 R11.1 20.11,52.1 C6.1 20.13,50.61 20.19,50.55 20.19,50.16 19.81,49.78 IC1.9 19.81,48.39 19.43,48.77 IC1.6 13.59,48.77 13.25,49.11 R6.1 | 20.11,62.44 20.11,62.57 J17.2 | IC2.9 19.81,37.97 19.68,38.1 IC2.6 15.49,38.1 15.03,37.63 R7.1 | C2.2 20.7,33.82 | 20.7,33.82 20.03,33.82 19.81,34.04 IC2.9 | 20.7,33.82 20.64,33.76 C8.1 20.64,30.54 20.7,30.48 19.81,29.59 IC3.9 | IC3.9 19.81,27.94 19.43,28.32 IC3.6 15.62,28.32 15.11,27.81 15.07,27.85 R8.1 | C3.2 20.7,24.04 | 20.7,24.04 20.03,24.04 19.81,24.26 IC3.9 | 20.7,24.04 20.7,21.91 C9.1 20.64,20.64 20.7,20.57 19.81,19.68 IC4.9 | IC4.9 19.81,18.29 IC4.6 15.88,18.29 15.41,17.82 R9.1 | C4.2 20.64,14.01 | 20.64,14.01 20.28,14.01 19.81,14.48 IC4.9 | 20.64,14.01 C10.1 20.64,10.99 19.81,10.16 19.81,8.64 | 19.81,8.64 IC5.9 19.81,5.59 20.92,4.48 C5.2 | 19.81,8.64 19.68,8.76 IC5.6 15.24,8.76 14.77,8.29 R10.1 | 20.11,62.44 21.07,62.73 J17.2 | 20.11,62.44 20.24,63.43 J17.2 | C7.1 20.39,40.07 19.81,39.5 IC2.9
  pour Bottom (isolate 0.508): 0,0 0,69.98 46.23,69.98 46.23,0
  pour Top (isolate 0.508): 0,69.98 22.61,69.98 22.61,60.71 23.88,59.44 23.88,51.82 25.4,50.29 30.48,50.29 31.5,49.28 31.5,39.62 36.58,34.54 46.23,34.54 46.23,0 0,0
N$5
  Top 0.508: R1.2 29.08,44.49 D1.C
N$6
  Top 0.508: R2.2 29.08,33.82 D2.C
N$7
  Top 0.508: R3.2 29.08,24.04 D3.C
N$8
  Top 0.508: R4.2 29.03,14.01 D4.C
N$9
  Top 0.508: R5.2 29.08,4.48 D5.C
N$10
  Top 0.508: LED1.C 21.83,54.99 R11.2
PWM  (via drill 0.35, 0.4, 0.6)
  Top 0.508: v24.64,47.5 24.04,47.5 | 24.04,47.5 | 24.04,47.5 IC1.2 | J1.2 7.32,43.57 | 7.32,43.57 | 7.32,43.57 11.25,47.5 11.8,47.5 | 11.8,47.5 | 11.8,47.5 v12.7,47.5 | IC2.2 24.04,36.83 | 24.04,36.83 | 24.04,36.83 v24.64,36.83 | IC3.2 24.11,27.05 | 24.11,27.05 | 24.11,27.05 v24.64,27.05 | IC4.2 24.04,17.02 | 24.04,17.02 | 24.04,17.02 v24.64,17.02 | IC5.2 24.04,7.49 | 24.04,7.49 | 24.04,7.49 v24.64,7.49 | 24.04,47.5 24.6,47.35 | 24.04,47.5 24.6,47.64 | 11.8,47.5 12.63,47.26 | 12.63,47.26 | v12.7,47.5 12.63,47.26 | 11.8,47.5 12.63,47.74 | 24.04,36.83 24.6,36.69 | 24.04,36.83 24.6,36.98 | 24.11,27.05 24.61,26.93 | 24.11,27.05 24.61,27.17 | 24.04,17.02 24.6,16.87 | 24.04,17.02 24.6,17.16 | 24.04,7.49 24.6,7.35 | 24.04,7.49 24.6,7.64 | 24.04,47.5 | 24.04,47.5 24.6,47.35 | 24.6,47.35 | v24.64,47.5 24.6,47.35 | 24.04,47.5 24.6,47.64 | 24.6,47.64 | v24.64,47.5 24.6,47.64 | 24.04,47.5 24.6,47.35 | 24.04,47.5 24.6,47.64 | 24.04,47.5 24.6,47.35 | v24.64,47.5 24.6,47.35 | 24.04,47.5 24.6,47.64 | v24.64,47.5 24.6,47.64 | 11.8,47.5 12.63,47.26 | 11.8,47.5 | 11.8,47.5 12.63,47.26 | v12.7,47.5 12.63,47.26 | 11.8,47.5 12.63,47.74 | 12.63,47.74 | v12.7,47.5 12.63,47.74 | 11.8,47.5 12.63,47.26 | 11.8,47.5 12.63,47.74 | 11.8,47.5 12.63,47.26 | v12.7,47.5 12.63,47.26 | 11.8,47.5 12.63,47.74 | v12.7,47.5 12.63,47.74 | 24.04,36.83 | 24.04,36.83 24.6,36.69 | 24.6,36.69 | v24.64,36.83 24.6,36.69 | 24.04,36.83 24.6,36.98 | 24.6,36.98 | v24.64,36.83 24.6,36.98 | 24.04,36.83 24.6,36.69 | 24.04,36.83 24.6,36.98 | 24.04,36.83 24.6,36.69 | v24.64,36.83 24.6,36.69 | 24.04,36.83 24.6,36.98 | v24.64,36.83 24.6,36.98 | 24.11,27.05 | 24.11,27.05 24.61,26.93 | 24.61,26.93 | v24.64,27.05 24.61,26.93 | 24.11,27.05 24.61,27.17 | 24.61,27.17 | v24.64,27.05 24.61,27.17
  Top 0.508: 24.11,27.05 24.61,26.93 | 24.11,27.05 24.61,27.17 | 24.11,27.05 24.61,26.93 | v24.64,27.05 24.61,26.93 | 24.11,27.05 24.61,27.17 | v24.64,27.05 24.61,27.17 | 24.04,17.02 | 24.04,17.02 24.6,16.87 | 24.6,16.87 | v24.64,17.02 24.6,16.87 | 24.04,17.02 24.6,17.16 | 24.6,17.16 | v24.64,17.02 24.6,17.16 | 24.04,17.02 24.6,16.87 | 24.04,17.02 24.6,17.16 | 24.04,17.02 24.6,16.87 | v24.64,17.02 24.6,16.87 | 24.04,17.02 24.6,17.16 | v24.64,17.02 24.6,17.16 | 24.04,7.49 | 24.04,7.49 24.6,7.35 | 24.6,7.35 | v24.64,7.49 24.6,7.35 | 24.04,7.49 24.6,7.64 | 24.6,7.64 | v24.64,7.49 24.6,7.64 | 24.04,7.49 24.6,7.35 | 24.04,7.49 24.6,7.64 | 24.04,7.49 24.6,7.35 | v24.64,7.49 24.6,7.35 | 24.04,7.49 24.6,7.64 | v24.64,7.49 24.6,7.64 | 7.32,43.57 6.34,43.35 | 6.34,43.35 | 7.32,43.57 7.1,42.58 | 7.32,43.57 6.34,43.35 | J1.2 6.34,43.35 | 7.32,43.57 7.1,42.58 | 7.1,42.58 | 7.32,43.57 6.34,43.35 | J1.2 6.34,43.35 | 7.32,43.57 7.1,42.58 | J1.2 7.1,42.58
  Bottom 0.508: v12.7,47.5 13.6,47.5 | 13.6,47.5 | 13.6,47.5 24.04,47.5 | 24.04,47.5 | 24.04,47.5 v24.64,47.5 | 12.37,36.83 7.32,41.88 | 7.32,41.88 | 7.32,41.88 J1.2 | v24.64,36.83 24.04,36.83 | 24.04,36.83 | 24.04,36.83 12.37,36.83 | v24.64,27.05 24.11,27.05 | 24.11,27.05 | 24.11,27.05 12.57,27.05 12.37,27.25 | 12.37,27.25 12.37,36.83 | v24.64,17.02 24.04,17.02 | 24.04,17.02 | 24.04,17.02 12.37,17.02 | 12.37,17.02 12.37,27.25 | v24.64,7.49 24.04,7.49 | 24.04,7.49 | 24.04,7.49 16.51,7.49 12.37,11.63 12.37,17.02 | 24.04,47.5 24.6,47.35 | 24.04,47.5 24.6,47.64 | 13.6,47.5 12.77,47.74 | 13.6,47.5 12.77,47.26 | 12.77,47.74 | 12.77,47.26 | v12.7,47.5 12.77,47.26 | 24.04,36.83 24.6,36.69 | 24.04,36.83 24.6,36.98 | 24.11,27.05 24.61,26.93 | 24.11,27.05 24.61,27.17 | 24.04,17.02 24.6,16.87 | 24.04,17.02 24.6,17.16 | 24.04,7.49 24.6,7.35 | 24.04,7.49 24.6,7.64 | 24.04,47.5 | 24.04,47.5 24.6,47.35 | 24.6,47.35 | v24.64,47.5 24.6,47.35 | 24.04,47.5 24.6,47.64 | 24.6,47.64 | v24.64,47.5 24.6,47.64 | 24.04,47.5 24.6,47.35 | 24.04,47.5 24.6,47.64 | 24.04,47.5 24.6,47.35 | v24.64,47.5 24.6,47.35 | 24.04,47.5 24.6,47.64 | v24.64,47.5 24.6,47.64 | 13.6,47.5 12.77,47.74 | 13.6,47.5 | 13.6,47.5 12.77,47.26 | 13.6,47.5 12.77,47.74 | v12.7,47.5 12.77,47.74 | 13.6,47.5 12.77,47.26 | v12.7,47.5 12.77,47.26 | 13.6,47.5 12.77,47.74 | v12.7,47.5 12.77,47.74 | 13.6,47.5 12.77,47.26 | v12.7,47.5 12.77,47.26 | 24.04,36.83 | 24.04,36.83 24.6,36.69 | 24.6,36.69 | v24.64,36.83 24.6,36.69 | 24.04,36.83 24.6,36.98 | 24.6,36.98 | v24.64,36.83 24.6,36.98 | 24.04,36.83 24.6,36.69 | 24.04,36.83 24.6,36.98 | 24.04,36.83 24.6,36.69 | v24.64,36.83 24.6,36.69 | 24.04,36.83 24.6,36.98 | v24.64,36.83 24.6,36.98 | 24.11,27.05 | 24.11,27.05 24.61,26.93 | 24.61,26.93
  Bottom 0.508: v24.64,27.05 24.61,26.93 | 24.11,27.05 24.61,27.17 | 24.61,27.17 | v24.64,27.05 24.61,27.17 | 24.11,27.05 24.61,26.93 | 24.11,27.05 24.61,27.17 | 24.11,27.05 24.61,26.93 | v24.64,27.05 24.61,26.93 | 24.11,27.05 24.61,27.17 | v24.64,27.05 24.61,27.17 | 24.04,17.02 | 24.04,17.02 24.6,16.87 | 24.6,16.87 | v24.64,17.02 24.6,16.87 | 24.04,17.02 24.6,17.16 | 24.6,17.16 | v24.64,17.02 24.6,17.16 | 24.04,17.02 24.6,16.87 | 24.04,17.02 24.6,17.16 | 24.04,17.02 24.6,16.87 | v24.64,17.02 24.6,16.87 | 24.04,17.02 24.6,17.16 | v24.64,17.02 24.6,17.16 | 24.04,7.49 | 24.04,7.49 24.6,7.35 | 24.6,7.35 | v24.64,7.49 24.6,7.35 | 24.04,7.49 24.6,7.64 | 24.6,7.64 | v24.64,7.49 24.6,7.64 | 24.04,7.49 24.6,7.35 | 24.04,7.49 24.6,7.64 | 24.04,7.49 24.6,7.35 | v24.64,7.49 24.6,7.35 | 24.04,7.49 24.6,7.64 | v24.64,7.49 24.6,7.64 | 7.32,41.88 7.1,42.86 | 7.1,42.86 | 7.32,41.88 | 7.32,41.88 6.34,42.1 | 7.32,41.88 7.1,42.86 | J1.2 7.1,42.86 | 7.32,41.88 6.34,42.1 | 6.34,42.1 | 7.32,41.88 7.1,42.86 | J1.2 7.1,42.86 | 7.32,41.88 6.34,42.1 | J1.2 6.34,42.1
VCC
  Top 0.508: D1.A 35.94,44.45 37.97,46.48 38.68,46.48 | D5.A D4.A D3.A D2.A 32.6,35.73 39.03,42.16 | 38.68,46.48 J5.1 | 39.03,42.16 J7.2 | 38.68,46.48 39.53,45.94 J5.1 | 38.68,46.48 39.53,47.02 J5.1 | 39.03,42.16 40.02,42.38 J7.2 | 39.03,42.16 39.25,43.14 J7.2
  Top 0.762: 25.23,62.5 26.79,60.94 LED1.A 33.07,54.99 35.05,56.97 38.68,56.97 | 25.23,62.5 J17.1 | J6.2 38.68,56.97 | J6.2 39.88,55.78 | 39.88,55.78 39.88,54.66 | 39.88,54.66 J6.1 | J6.1 39.88,52.27 | 39.88,52.27 39.88,51.18 | 39.88,51.18 J5.2 | J5.2 39.88,48.79 | 39.88,48.79 39.88,47.68 | 39.88,47.68 J5.1 | J5.1 39.88,45.29 | 39.88,45.29 39.88,44.2 | 39.88,44.2 J7.2 | 39.88,51.18 39.41,50.21 J5.2 | 39.88,51.18 40.34,50.21 J5.2 | 39.88,48.79 40.34,49.77 J5.2 | 39.88,48.79 39.41,49.77 J5.2 | 39.88,47.68 39.41,46.7 J5.1 | 39.88,47.68 40.34,46.7 J5.1 | 39.88,45.29 40.34,46.26 J5.1 | 39.88,45.29 39.41,46.26 J5.1 | 38.68,56.97 39.66,56.51 J6.2 | 38.68,56.97 39.66,57.44 J6.2 | 39.88,55.78 40.34,56.75 J6.2 | 39.88,55.78 39.41,56.75 J6.2 | 39.88,54.66 39.41,53.69 J6.1 | 39.88,54.66 40.34,53.69 J6.1 | 39.88,52.27 40.34,53.24 J6.1 | 39.88,52.27 39.41,53.24 J6.1 | 39.88,44.2 39.41,43.22 J7.2 | 39.88,44.2 40.34,43.22 J7.2 | 25.23,62.5 24.87,63.52 J17.1 | 25.23,62.5 24.21,62.86 J17.1
  pour Top (isolate 0.508, rank 2): 23.5,69.98 23.5,60.83 24.51,59.82 24.51,52.32 25.65,51.18 30.86,51.18 32.26,49.78 32.26,40.13 36.96,35.43 46.23,35.43 46.23,69.98
VCC_IC1
  Top 0.508: IC1.1 24.6,46.23 C1.1
  Top 0.762: C1.1 R1.1
VCC_IC2
  Top 0.254: IC2.1 24.6,35.56 C2.1 R2.1
VCC_IC3
  Top 0.508: IC3.1 24.47,25.78 C3.1 R3.1
VCC_IC4
  Top 0.508: IC4.1 24.6,15.75 C4.1 R4.1
VCC_IC5
  Top 0.508: IC5.1 22.32,6.18 C5.1 R5.1

### Text on the board
tPlace: GND | VCC | POWER | VCC | EN | VCC | PWM | VCC | DISC1 | DISC2 | DRAIN1 | DISC3 | DRAIN2 | DISC4 | DRAIN3 | DISC5 | DRAIN4 | DRAIN5 | DRIVER LED V1.0